# Altium schematic sheet TH02.SchDoc
size A4; SheetNumber: 4; SheetTotal: 6
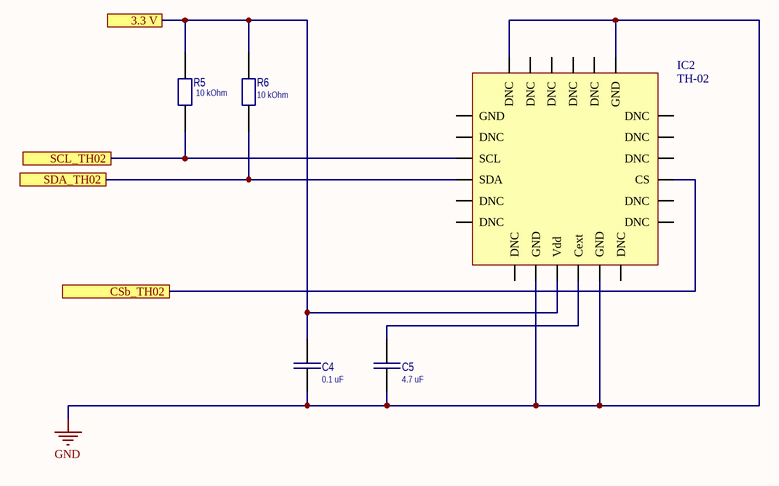
[diagram p0: TH02.SchDoc]

## Parts
C4  0.1 uF  [C_0805]
C5  4.7 uF  [C_0805]
IC2  TH-02  [TH-02]
R5  10 kOhm  [R_0805]
R6  10 kOhm  [R_0805]

## Ports
3.3 V (see MainSheet[4A], BME280[2B], DC-DC_MC34063[1B], DS18B20[2C], STM32F103C8T6[1C]), CSb_TH02 (see MainSheet[3B], STM32F103C8T6[3B]), SCL_TH02 (see MainSheet[3B], STM32F103C8T6[3B]), SDA_TH02 (see MainSheet[3B], STM32F103C8T6[3B])

## Nets
GND: C4.1 C5.1 IC2.8(GND) IC2.11(GND) IC2.19(GND) IC2.24(DNC)
3.3 V: C4.2 IC2.9(Vdd) R5.2 R6.2 ; port 3.3 V
CSb_TH02: IC2.15(CS) ; port CSb_TH02
SCL_TH02: IC2.3(SCL) R5.1 ; port SCL_TH02
SDA_TH02: IC2.4(SDA) R6.1 ; port SDA_TH02
NetC5_2: C5.2 IC2.10(Cext)

Not connected (* = marked no-connect by the designer): IC2 1(GND) 2(DNC) 5(DNC) 6(DNC) 7(DNC) 12(DNC) 13(DNC) 14(DNC) 16(DNC) 17(DNC) 18(DNC) 20(DNC) 21(DNC) 22(DNC) 23(DNC)

## Library data of the parts
C4 C5 = C0805: Capacitor
  C4: Value: 0.1 uF
  C5: Value: 4.7 uF
IC2 = TH_02: Temperature and humidity sensor
R5 R6 = R0805: Resistor; Value: 10 kOhm